# EasyEDA schematic SCH_SCHEMA-LED-3.0_2025-04-29.json
TITLE: Sheet_1; REV: 1.0; Date: 2025-02-06; Sheet: 1/1; Drawn By: abybrchrd; Company: Your Company
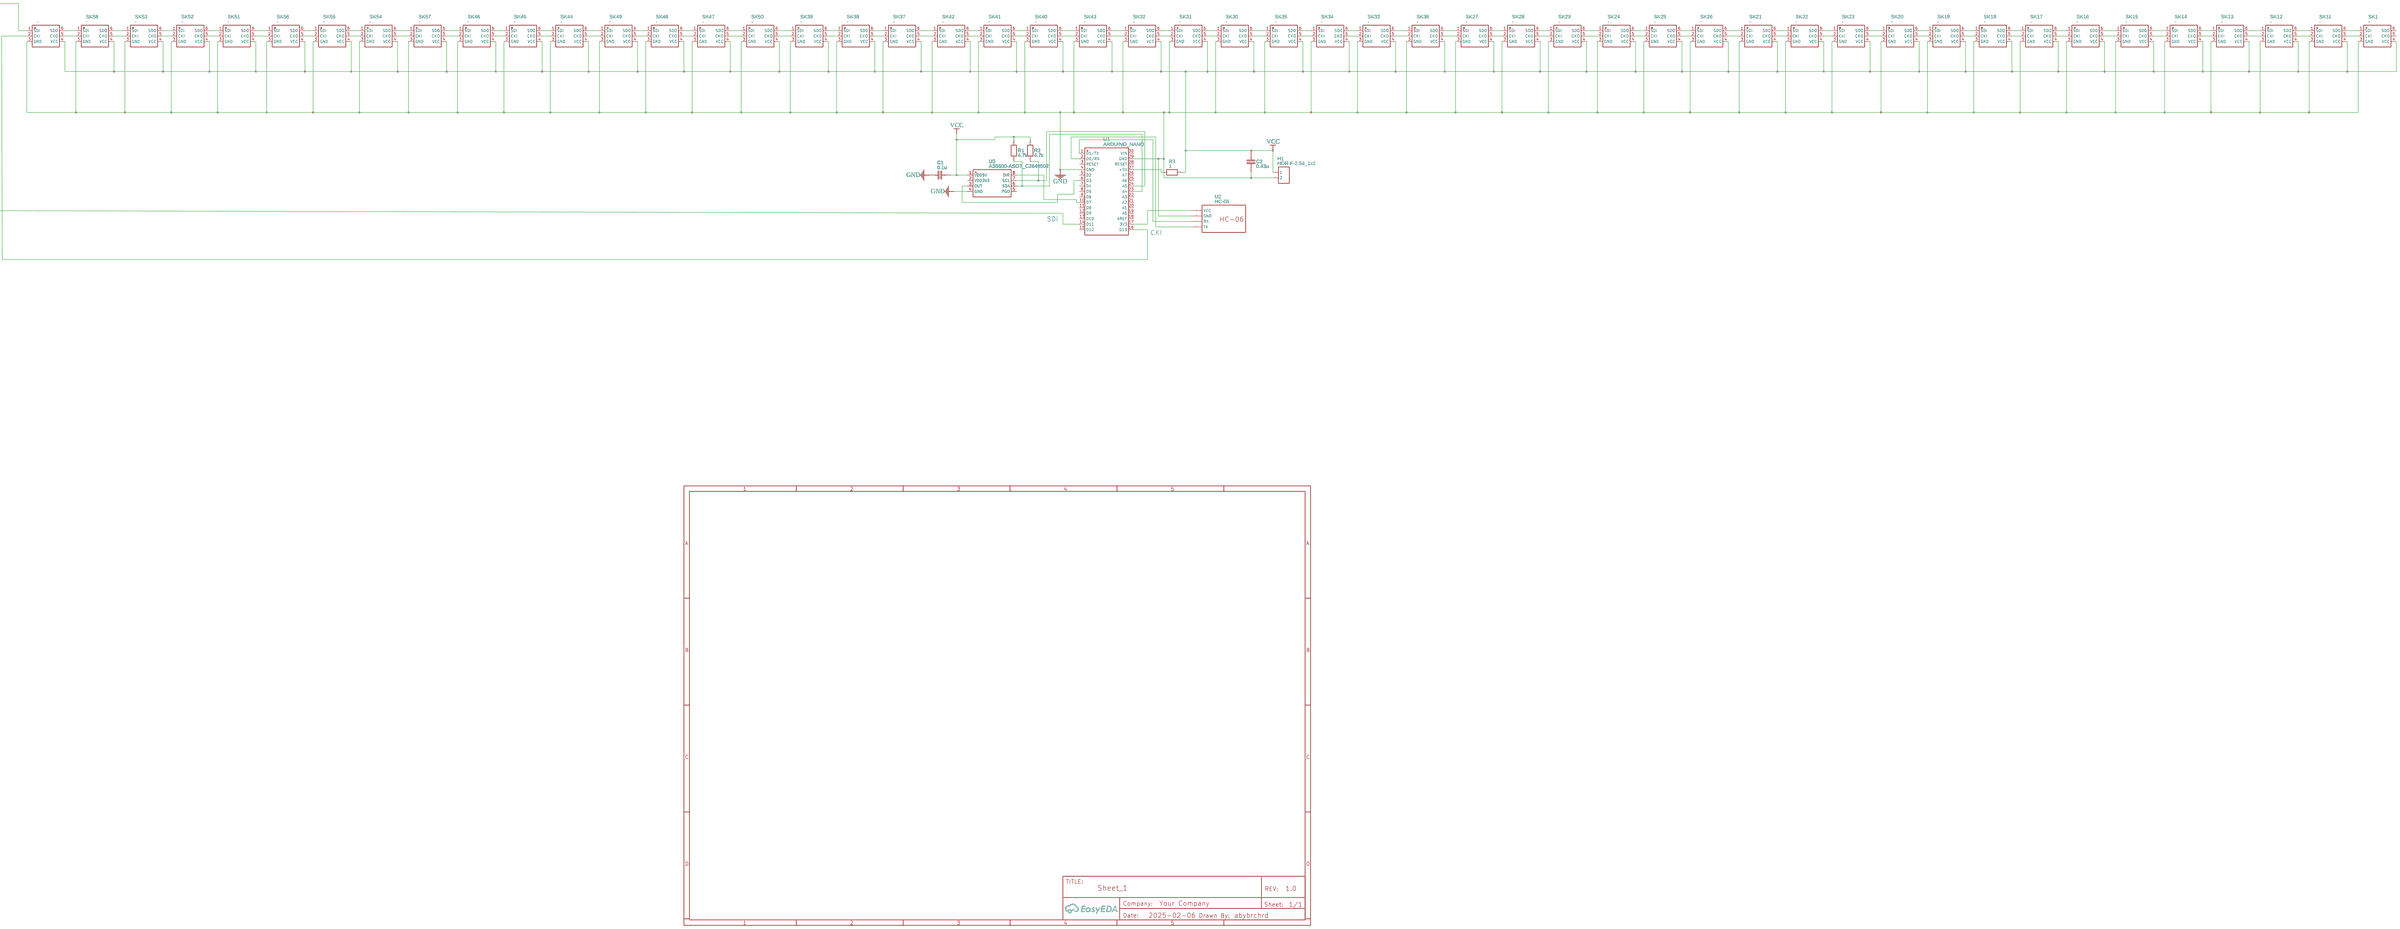
[diagram p0: schematic sheet]

## Parts
C1  0.1u  [C0603]
C2  0.43u  [C1206]
H1  HDR-F-2.54_1x2  [HDR-F-2.54_1X2]
R1  4.7k  [R0603]
R2  4.7k  [R0603]
R3  1  [R0603]
SK1  -  [SMD_6P-L5.0-W5.0-TL]
SK11  -  [SMD_6P-L5.0-W5.0-TL]
SK12  -  [SMD_6P-L5.0-W5.0-TL]
SK13  -  [SMD_6P-L5.0-W5.0-TL]
SK14  -  [SMD_6P-L5.0-W5.0-TL]
SK15  -  [SMD_6P-L5.0-W5.0-TL]
SK16  -  [SMD_6P-L5.0-W5.0-TL]
SK17  -  [SMD_6P-L5.0-W5.0-TL]
SK18  -  [SMD_6P-L5.0-W5.0-TL]
SK19  -  [SMD_6P-L5.0-W5.0-TL]
SK20  -  [SMD_6P-L5.0-W5.0-TL]
SK21  -  [SMD_6P-L5.0-W5.0-TL]
SK22  -  [SMD_6P-L5.0-W5.0-TL]
SK23  -  [SMD_6P-L5.0-W5.0-TL]
SK24  -  [SMD_6P-L5.0-W5.0-TL]
SK25  -  [SMD_6P-L5.0-W5.0-TL]
SK26  -  [SMD_6P-L5.0-W5.0-TL]
SK27  -  [SMD_6P-L5.0-W5.0-TL]
SK28  -  [SMD_6P-L5.0-W5.0-TL]
SK29  -  [SMD_6P-L5.0-W5.0-TL]
SK30  -  [SMD_6P-L5.0-W5.0-TL]
SK31  -  [SMD_6P-L5.0-W5.0-TL]
SK32  -  [SMD_6P-L5.0-W5.0-TL]
SK33  -  [SMD_6P-L5.0-W5.0-TL]
SK34  -  [SMD_6P-L5.0-W5.0-TL]
SK35  -  [SMD_6P-L5.0-W5.0-TL]
SK36  -  [SMD_6P-L5.0-W5.0-TL]
SK37  -  [SMD_6P-L5.0-W5.0-TL]
SK38  -  [SMD_6P-L5.0-W5.0-TL]
SK39  -  [SMD_6P-L5.0-W5.0-TL]
SK40  -  [SMD_6P-L5.0-W5.0-TL]
SK41  -  [SMD_6P-L5.0-W5.0-TL]
SK42  -  [SMD_6P-L5.0-W5.0-TL]
SK43  -  [SMD_6P-L5.0-W5.0-TL]
SK44  -  [SMD_6P-L5.0-W5.0-TL]
SK45  -  [SMD_6P-L5.0-W5.0-TL]
SK46  -  [SMD_6P-L5.0-W5.0-TL]
SK47  -  [SMD_6P-L5.0-W5.0-TL]
SK48  -  [SMD_6P-L5.0-W5.0-TL]
SK49  -  [SMD_6P-L5.0-W5.0-TL]
SK50  -  [SMD_6P-L5.0-W5.0-TL]
SK51  -  [SMD_6P-L5.0-W5.0-TL]
SK52  -  [SMD_6P-L5.0-W5.0-TL]
SK53  -  [SMD_6P-L5.0-W5.0-TL]
SK54  -  [SMD_6P-L5.0-W5.0-TL]
SK55  -  [SMD_6P-L5.0-W5.0-TL]
SK56  -  [SMD_6P-L5.0-W5.0-TL]
SK57  -  [SMD_6P-L5.0-W5.0-TL]
SK58  -  [SMD_6P-L5.0-W5.0-TL]
SK59  -  [SMD_6P-L5.0-W5.0-TL]
U1  ARDUINO_NANO  [COMM-TH_ARDUINO_NANO]
U2  HC-06  [HC-06]
U3  AS5600-ASOT_C2649502  [SOIC-8_L5.0-W4.0-P1.27-LS6.0-BL]

## Library data of the parts
C1 = C_0603_EU: Contributor: LCEDA_Lib
C2 = C_1206_EU: Contributor: LCEDA_Lib
H1 = HDR-F-2.54_1x2: Supplier Part: C49661; Supplier: LCSC; Contributor: LCEDA_Lib
R1-R3 = R_0603_EU: Contributor: LCEDA_Lib
SK1 SK11-SK59 = SK9822: Contributor: LELAUMAR; Supplier: LCSC; Supplier Part: C2829089; Manufacturer: 欧思科光电; JLCPCB Part Class: Extended Part
U1 = ARDUINO_NANO: Contributor: lcsc; Supplier: LCSC; Supplier Part: C9900017879; Manufacturer: null; JLCPCB Part Class: Extended Part
U2 = HC-06: Contributor: nico.hampl1999; sourceId: 31jdvN5mE
U3 = AS5600-ASOT_C2649502: Contributor: LCSC; Supplier: LCSC; Supplier Part: C2649502; Manufacturer: ams(艾迈斯半导体); Manufacturer Part: AS5600-ASOT; JLCPCB Part Class: Extended Part

## Nets
GND: C1.1 C2.1 H1.2 SK1.3(GND) SK11.3(GND) SK12.3(GND) SK13.3(GND) SK14.3(GND) SK15.3(GND) SK16.3(GND) SK17.3(GND) SK18.3(GND) SK19.3(GND) SK20.3(GND) SK21.3(GND) SK22.3(GND) SK23.3(GND) SK24.3(GND) SK25.3(GND) SK26.3(GND) SK27.3(GND) SK28.3(GND) SK29.3(GND) SK30.3(GND) SK31.3(GND) SK32.3(GND) SK33.3(GND) SK34.3(GND) SK35.3(GND) SK36.3(GND) SK37.3(GND) SK38.3(GND) SK39.3(GND) SK40.3(GND) SK41.3(GND) SK42.3(GND) SK43.3(GND) SK44.3(GND) SK45.3(GND) SK46.3(GND) SK47.3(GND) SK48.3(GND) SK49.3(GND) SK50.3(GND) SK51.3(GND) SK52.3(GND) SK53.3(GND) SK54.3(GND) SK55.3(GND) SK56.3(GND) SK57.3(GND) SK58.3(GND) SK59.3(GND) U1.4(GND) U1.29(GND) U2.3(GND) U3.4(GND)
VCC: C1.2 C2.2 H1.1 R1.2 R2.2 R3.2 SK1.4(VCC) SK11.4(VCC) SK12.4(VCC) SK13.4(VCC) SK14.4(VCC) SK15.4(VCC) SK16.4(VCC) SK17.4(VCC) SK18.4(VCC) SK19.4(VCC) SK20.4(VCC) SK21.4(VCC) SK22.4(VCC) SK23.4(VCC) SK24.4(VCC) SK25.4(VCC) SK26.4(VCC) SK27.4(VCC) SK28.4(VCC) SK29.4(VCC) SK30.4(VCC) SK31.4(VCC) SK32.4(VCC) SK33.4(VCC) SK34.4(VCC) SK35.4(VCC) SK36.4(VCC) SK37.4(VCC) SK38.4(VCC) SK39.4(VCC) SK40.4(VCC) SK41.4(VCC) SK42.4(VCC) SK43.4(VCC) SK44.4(VCC) SK45.4(VCC) SK46.4(VCC) SK47.4(VCC) SK48.4(VCC) SK49.4(VCC) SK50.4(VCC) SK51.4(VCC) SK52.4(VCC) SK53.4(VCC) SK54.4(VCC) SK55.4(VCC) SK56.4(VCC) SK57.4(VCC) SK58.4(VCC) SK59.4(VCC) U3.1(VDD5V)
Net-(R1-1): R1.1 U1.23(A4) U3.6(SDA)
Net-(R2-1): R2.1 U1.24(A5) U3.7(SCL)
Net-(R3-1): R3.1 U1.27(+5V)
Net-(SK1-1): SK1.1(SDI) SK11.6(SDO)
Net-(SK1-2): SK1.2(CKI) SK11.5(CKO)
Net-(SK11-1): SK11.1(SDI) SK12.6(SDO)
Net-(SK11-2): SK11.2(CKI) SK12.5(CKO)
Net-(SK12-1): SK12.1(SDI) SK13.6(SDO)
Net-(SK12-2): SK12.2(CKI) SK13.5(CKO)
Net-(SK13-1): SK13.1(SDI) SK14.6(SDO)
Net-(SK13-2): SK13.2(CKI) SK14.5(CKO)
Net-(SK14-1): SK14.1(SDI) SK15.6(SDO)
Net-(SK14-2): SK14.2(CKI) SK15.5(CKO)
Net-(SK15-1): SK15.1(SDI) SK16.6(SDO)
Net-(SK15-2): SK15.2(CKI) SK16.5(CKO)
Net-(SK16-1): SK16.1(SDI) SK17.6(SDO)
Net-(SK16-2): SK16.2(CKI) SK17.5(CKO)
Net-(SK17-1): SK17.1(SDI) SK18.6(SDO)
Net-(SK17-2): SK17.2(CKI) SK18.5(CKO)
Net-(SK18-1): SK18.1(SDI) SK19.6(SDO)
Net-(SK18-2): SK18.2(CKI) SK19.5(CKO)
Net-(SK19-1): SK19.1(SDI) SK20.6(SDO)
Net-(SK19-2): SK19.2(CKI) SK20.5(CKO)
Net-(SK20-1): SK20.1(SDI) SK23.6(SDO)
Net-(SK20-2): SK20.2(CKI) SK23.5(CKO)
Net-(SK21-1): SK21.1(SDI) SK26.6(SDO)
Net-(SK21-2): SK21.2(CKI) SK26.5(CKO)
Net-(SK21-5): SK21.5(CKO) SK22.2(CKI)
Net-(SK21-6): SK21.6(SDO) SK22.1(SDI)
Net-(SK22-5): SK22.5(CKO) SK23.2(CKI)
Net-(SK22-6): SK22.6(SDO) SK23.1(SDI)
Net-(SK24-1): SK24.1(SDI) SK29.6(SDO)
Net-(SK24-2): SK24.2(CKI) SK29.5(CKO)
Net-(SK24-5): SK24.5(CKO) SK25.2(CKI)
Net-(SK24-6): SK24.6(SDO) SK25.1(SDI)
Net-(SK25-5): SK25.5(CKO) SK26.2(CKI)
Net-(SK25-6): SK25.6(SDO) SK26.1(SDI)
Net-(SK27-1): SK27.1(SDI) SK36.6(SDO)
Net-(SK27-2): SK27.2(CKI) SK36.5(CKO)
Net-(SK27-5): SK27.5(CKO) SK28.2(CKI)
Net-(SK27-6): SK27.6(SDO) SK28.1(SDI)
Net-(SK28-5): SK28.5(CKO) SK29.2(CKI)
Net-(SK28-6): SK28.6(SDO) SK29.1(SDI)
Net-(SK30-1): SK30.1(SDI) SK31.6(SDO)
Net-(SK30-2): SK30.2(CKI) SK31.5(CKO)
Net-(SK30-5): SK30.5(CKO) SK35.2(CKI)
Net-(SK30-6): SK30.6(SDO) SK35.1(SDI)
Net-(SK31-1): SK31.1(SDI) SK32.6(SDO)
Net-(SK31-2): SK31.2(CKI) SK32.5(CKO)
Net-(SK32-1): SK32.1(SDI) SK43.6(SDO)
Net-(SK32-2): SK32.2(CKI) SK43.5(CKO)
Net-(SK33-1): SK33.1(SDI) SK34.6(SDO)
Net-(SK33-2): SK33.2(CKI) SK34.5(CKO)
Net-(SK33-5): SK33.5(CKO) SK36.2(CKI)
Net-(SK33-6): SK33.6(SDO) SK36.1(SDI)
Net-(SK34-1): SK34.1(SDI) SK35.6(SDO)
Net-(SK34-2): SK34.2(CKI) SK35.5(CKO)
Net-(SK37-1): SK37.1(SDI) SK38.6(SDO)
Net-(SK37-2): SK37.2(CKI) SK38.5(CKO)
Net-(SK37-5): SK37.5(CKO) SK42.2(CKI)
Net-(SK37-6): SK37.6(SDO) SK42.1(SDI)
Net-(SK38-1): SK38.1(SDI) SK39.6(SDO)
Net-(SK38-2): SK38.2(CKI) SK39.5(CKO)
Net-(SK39-1): SK39.1(SDI) SK50.6(SDO)
Net-(SK39-2): SK39.2(CKI) SK50.5(CKO)
Net-(SK40-1): SK40.1(SDI) SK41.6(SDO)
Net-(SK40-2): SK40.2(CKI) SK41.5(CKO)
Net-(SK40-5): SK40.5(CKO) SK43.2(CKI)
Net-(SK40-6): SK40.6(SDO) SK43.1(SDI)
Net-(SK41-1): SK41.1(SDI) SK42.6(SDO)
Net-(SK41-2): SK41.2(CKI) SK42.5(CKO)
Net-(SK44-1): SK44.1(SDI) SK45.6(SDO)
Net-(SK44-2): SK44.2(CKI) SK45.5(CKO)
Net-(SK44-5): SK44.5(CKO) SK49.2(CKI)
Net-(SK44-6): SK44.6(SDO) SK49.1(SDI)
Net-(SK45-1): SK45.1(SDI) SK46.6(SDO)
Net-(SK45-2): SK45.2(CKI) SK46.5(CKO)
Net-(SK46-1): SK46.1(SDI) SK57.6(SDO)
Net-(SK46-2): SK46.2(CKI) SK57.5(CKO)
Net-(SK47-1): SK47.1(SDI) SK48.6(SDO)
Net-(SK47-2): SK47.2(CKI) SK48.5(CKO)
Net-(SK47-5): SK47.5(CKO) SK50.2(CKI)
Net-(SK47-6): SK47.6(SDO) SK50.1(SDI)
Net-(SK48-1): SK48.1(SDI) SK49.6(SDO)
Net-(SK48-2): SK48.2(CKI) SK49.5(CKO)
Net-(SK51-1): SK51.1(SDI) SK52.6(SDO)
Net-(SK51-2): SK51.2(CKI) SK52.5(CKO)
Net-(SK51-5): SK51.5(CKO) SK56.2(CKI)
Net-(SK51-6): SK51.6(SDO) SK56.1(SDI)
Net-(SK52-1): SK52.1(SDI) SK53.6(SDO)
Net-(SK52-2): SK52.2(CKI) SK53.5(CKO)
Net-(SK53-1): SK53.1(SDI) SK58.6(SDO)
Net-(SK53-2): SK53.2(CKI) SK58.5(CKO)
Net-(SK54-1): SK54.1(SDI) SK55.6(SDO)
Net-(SK54-2): SK54.2(CKI) SK55.5(CKO)
Net-(SK54-5): SK54.5(CKO) SK57.2(CKI)
Net-(SK54-6): SK54.6(SDO) SK57.1(SDI)
Net-(SK55-1): SK55.1(SDI) SK56.6(SDO)
Net-(SK55-2): SK55.2(CKI) SK56.5(CKO)
Net-(SK58-1): SK58.1(SDI) SK59.6(SDO)
Net-(SK58-2): SK58.2(CKI) SK59.5(CKO)
Net-(SK59-1): SK59.1(SDI) U1.14(D11)
Net-(SK59-2): SK59.2(CKI) U1.16(D13)
Net-(U1-1): U1.1(D1/TX) U2.2(RX)
Net-(U1-2): U1.2(D0/RX) U2.1(TX)
Net-(U1-6): U1.6(D3) U3.3(OUT)
Net-(U1-10): U1.10(D7) U3.8(DIR)
Net-(U1-17): U1.17(3V3) U2.4(VCC)

Not connected (* = marked no-connect by the designer): SK1 5(CKO) 6(SDO); U1 3(RESET) 5(D2) 7(D4) 8(D5) 9(D6) 11(D8) 12(D9) 13(D10) 15(D12) 18(AREF) 19(A0) 20(A1) 21(A2) 22(A3) 25(A6) 26(A7) 28(RESET) 30(VIN); U3 2(VDD3V3) 5(PGO)

## Notes on the sheet
- SDI
- CKI
